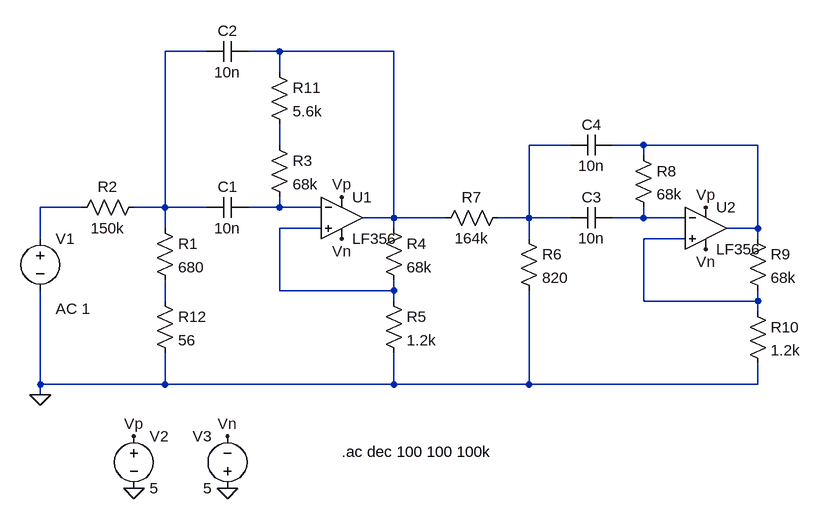
[diagram p0: schematic LowFrequencyFilter.asc]
LowFrequencyFilter.asc, the LTspice schematic file:
Version 4
SHEET 1 984 680
WIRE 48 -160 -16 -160
WIRE 160 -160 112 -160
WIRE 336 -160 160 -160
WIRE 160 -128 160 -160
WIRE 160 -16 160 -48
WIRE 608 -16 544 -16
WIRE 720 -16 672 -16
WIRE 896 -16 720 -16
WIRE 720 0 720 -16
WIRE -144 80 -208 80
WIRE -16 80 -16 -160
WIRE -16 80 -64 80
WIRE 48 80 -16 80
WIRE 160 80 160 64
WIRE 160 80 112 80
WIRE 224 80 160 80
WIRE 336 96 336 -160
WIRE 336 96 288 96
WIRE 416 96 336 96
WIRE 544 96 544 -16
WIRE 544 96 496 96
WIRE 608 96 544 96
WIRE 720 96 720 80
WIRE 720 96 672 96
WIRE 784 96 720 96
WIRE -16 112 -16 80
WIRE 224 112 160 112
WIRE 336 112 336 96
WIRE 896 112 896 -16
WIRE 896 112 848 112
WIRE -208 128 -208 80
WIRE 544 128 544 96
WIRE 784 128 720 128
WIRE 896 128 896 112
WIRE 160 208 160 112
WIRE 336 208 336 192
WIRE 336 208 160 208
WIRE -16 224 -16 192
WIRE 336 224 336 208
WIRE 720 224 720 128
WIRE 896 224 896 208
WIRE 896 224 720 224
WIRE 896 240 896 224
WIRE -208 352 -208 208
WIRE -16 352 -16 304
WIRE -16 352 -208 352
WIRE 336 352 336 304
WIRE 336 352 -16 352
WIRE 544 352 544 208
WIRE 544 352 336 352
WIRE 896 352 896 320
WIRE 896 352 544 352
WIRE -208 368 -208 352
FLAG -208 368 0
FLAG -64 512 0
FLAG 80 512 0
FLAG -64 432 Vp
FLAG 256 64 Vp
FLAG 816 80 Vp
FLAG 80 432 Vn
FLAG 256 128 Vn
FLAG 816 144 Vn
SYMBOL res -32 96 R0
SYMATTR InstName R1
SYMATTR Value 680
SYMBOL res -48 64 R90
WINDOW 0 0 56 VBottom 2
WINDOW 3 32 56 VTop 2
SYMATTR InstName R2
SYMATTR Value 150k
SYMBOL cap 112 64 R90
WINDOW 0 0 32 VBottom 2
WINDOW 3 32 32 VTop 2
SYMATTR InstName C1
SYMATTR Value 10n
SYMBOL cap 112 -176 R90
WINDOW 0 0 32 VBottom 2
WINDOW 3 32 32 VTop 2
SYMATTR InstName C2
SYMATTR Value 10n
SYMBOL res 144 -32 R0
SYMATTR InstName R3
SYMATTR Value 68k
SYMBOL LF356 256 32 R0
SYMATTR InstName U1
SYMBOL res 320 96 R0
SYMATTR InstName R4
SYMATTR Value 68k
SYMBOL res 320 208 R0
SYMATTR InstName R5
SYMATTR Value 1.2k
SYMBOL res 528 112 R0
SYMATTR InstName R6
SYMATTR Value 820
SYMBOL res 512 80 R90
WINDOW 0 0 56 VBottom 2
WINDOW 3 32 56 VTop 2
SYMATTR InstName R7
SYMATTR Value 164k
SYMBOL cap 672 80 R90
WINDOW 0 0 32 VBottom 2
WINDOW 3 32 32 VTop 2
SYMATTR InstName C3
SYMATTR Value 10n
SYMBOL cap 672 -32 R90
WINDOW 0 0 32 VBottom 2
WINDOW 3 32 32 VTop 2
SYMATTR InstName C4
SYMATTR Value 10n
SYMBOL res 704 -16 R0
SYMATTR InstName R8
SYMATTR Value 68k
SYMBOL LF356 816 48 R0
SYMATTR InstName U2
SYMBOL res 880 112 R0
SYMATTR InstName R9
SYMATTR Value 68k
SYMBOL res 880 224 R0
SYMATTR InstName R10
SYMATTR Value 1.2k
SYMBOL voltage -208 112 R0
WINDOW 123 24 124 Left 2
WINDOW 39 0 0 Left 0
SYMATTR Value2 AC 1
SYMATTR InstName V1
SYMATTR Value ""
SYMBOL voltage -64 416 R0
WINDOW 123 0 0 Left 0
WINDOW 39 0 0 Left 0
SYMATTR InstName V2
SYMATTR Value 5
SYMBOL voltage 80 528 R180
WINDOW 0 24 96 Left 2
WINDOW 3 24 16 Left 2
WINDOW 123 0 0 Left 0
WINDOW 39 0 0 Left 0
SYMATTR InstName V3
SYMATTR Value 5
SYMBOL res 144 -144 R0
SYMATTR InstName R11
SYMATTR Value 5.6k
SYMBOL res -32 208 R0
SYMATTR InstName R12
SYMATTR Value 56
TEXT 256 456 Left 2 !.ac dec 100 100 100k

The netlist it stands for:
* LowFrequencyFilter.asc
R1 N001 N011 680
R2 N001 N006 150k
C1 N007 N001 10n
C2 N002 N001 10n
R3 N003 N007 68k
XU1 N009 N007 Vp Vn N002 LF356  ; pins In+ In- V+ V- OUT
R4 N002 N009 68k
R5 N009 0 1.2k
R6 N004 0 820
R7 N004 N002 164k
C3 N008 N004 10n
C4 N005 N004 10n
R8 N005 N008 68k
XU2 N010 N008 Vp Vn N005 LF356  ; pins In+ In- V+ V- OUT
R9 N005 N010 68k
R10 N010 0 1.2k
V1 N006 0 AC 1
V2 Vp 0 5
V3 0 Vn 5
R11 N002 N003 5.6k
R12 N011 0 56
.ac dec 100 100 100k
.lib LF356.sub
.backanno
.end